# EAGLE schematic new_wiring (EAGLE 6.6.0)
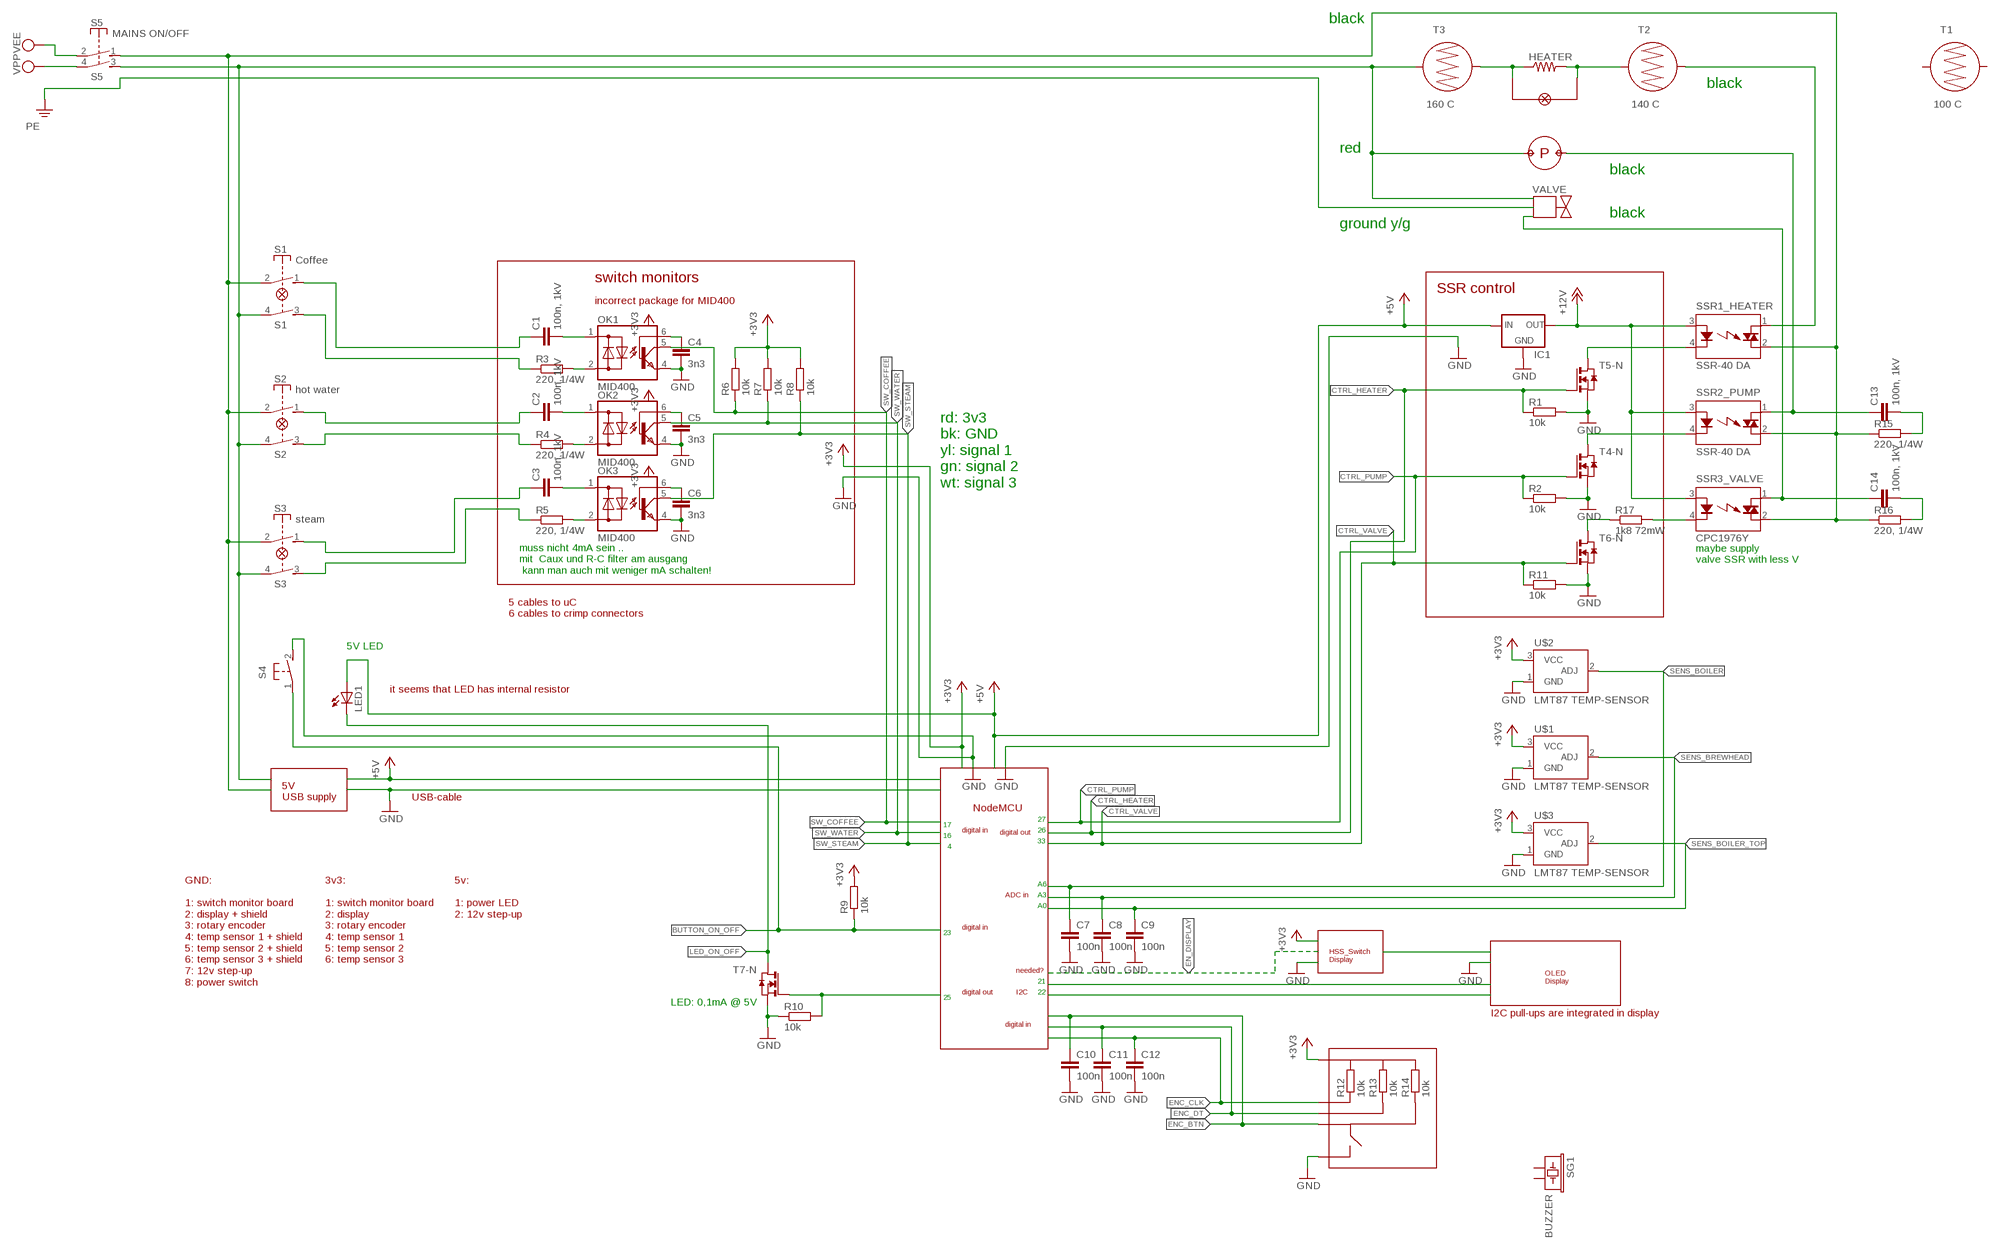
[diagram p0: schematic, sheet 1]

## Parts
C1  100n, 1kV  C-EU025-024X044  [C025-024X044]
C2  100n, 1kV  C-EU025-024X044  [C025-024X044]
C3  100n, 1kV  C-EU025-024X044  [C025-024X044]
C4  3n3  C-EU025-024X044  [C025-024X044]
C5  3n3  C-EU025-024X044  [C025-024X044]
C6  3n3  C-EU025-024X044  [C025-024X044]
C7  100n  C-EU025-024X044  [C025-024X044]
C8  100n  C-EU025-024X044  [C025-024X044]
C9  100n  C-EU025-024X044  [C025-024X044]
C10  100n  C-EU025-024X044  [C025-024X044]
C11  100n  C-EU025-024X044  [C025-024X044]
C12  100n  C-EU025-024X044  [C025-024X044]
C13  100n, 1kV  C-EU025-024X044  [C025-024X044]
C14  100n, 1kV  C-EU025-024X044  [C025-024X044]
FID1  FIDUCIAL1.5X3  [FIDUCIAL-1.5X3]
FID2  FIDUCIAL1.5X3  [FIDUCIAL-1.5X3]
FID3  FIDUCIAL1.5X3  [FIDUCIAL-1.5X3]
FID5  FIDUCIAL1.5X3  [FIDUCIAL-1.5X3]
HEATER  R-US_VTA52  [VTA52]
IC1  LM123-TO3  [TO3-K02]
LED1  LED-3MM-NO_SILK  [LED3MM-NS]
OK1  MID400  IL250  [DIL06]
OK2  MID400  IL250  [DIL06]
OK3  MID400  IL250  [DIL06]
R1  10k  R-EU_0613/5V  [P0613V]
R2  10k  R-EU_0613/5V  [P0613V]
R3  220, 1/4W  R-EU_0613/5V  [P0613V]
R4  220, 1/4W  R-EU_0613/5V  [P0613V]
R5  220, 1/4W  R-EU_0613/5V  [P0613V]
R6  10k  R-EU_0613/5V  [P0613V]
R7  10k  R-EU_0613/5V  [P0613V]
R8  10k  R-EU_0613/5V  [P0613V]
R9  10k  R-EU_0613/5V  [P0613V]
R10  10k  R-EU_0613/5V  [P0613V]
R11  10k  R-EU_0613/5V  [P0613V]
R12  10k  R-EU_0613/5V  [P0613V]
R13  10k  R-EU_0613/5V  [P0613V]
R14  10k  R-EU_0613/5V  [P0613V]
R15  220, 1/4W  R-EU_0613/5V  [P0613V]
R16  220, 1/4W  R-EU_0613/5V  [P0613V]
R17  1k8 72mW  R-EU_0613/5V  [P0613V]
S1  Coffee  PVA1  [PVA1F]
S2  hot water  PVA1  [PVA1F]
S3  steam  PVA1  [PVA1F]
S4  31-XX  [B3F-31XX]
S5  MAINS ON/OFF  PVA1  [PVA1F]
SG1  BUZZER  BUZZERNS  [BUZZER-12MM-NS]
SSR1_HEATER  SSR-40 DA  S101T01  [S102T0X]
SSR2_PUMP  SSR-40 DA  S101T01  [S102T0X]
SSR3_VALVE  CPC1976Y  S101T01  [S102T0X]
T1  100 C  BUTTON-CONDUCTIVESMD  [BUTTON-CONDUCTIVE]
T2  140 C  BUTTON-CONDUCTIVESMD  [BUTTON-CONDUCTIVE]
T3  160 C  BUTTON-CONDUCTIVESMD  [BUTTON-CONDUCTIVE]
T4  N/P-MOS-DMG1029SV  [SOT-563]
T5  N/P-MOS-DMG1029SV  [SOT-563]
T6  N/P-MOS-DMG1029SV  [SOT-563]
T7  N/P-MOS-DMG1029SV  [SOT-563]
TP1  TPB1,27  [B1,27]
TP2  TPB1,27  [B1,27]
U$1  LMT87 TEMP-SENSOR  TEMPERATURE-SENSOR  [TO-92]
U$2  LMT87 TEMP-SENSOR  TEMPERATURE-SENSOR  [TO-92]
U$3  LMT87 TEMP-SENSOR  TEMPERATURE-SENSOR  [TO-92]

## Nets
+3V3: R6.2 R7.2 R8.2 R9.2 U$1.3(VCC) U$2.3(VCC) U$3.3(VCC)
+5V: IC1.2(IN) LED1.A
+12V: IC1.1(OUT) SSR1_HEATER.3(A) SSR2_PUMP.3(A) SSR3_VALVE.3(A)
BUTTON_ON_OFF: R9.1 S4.1(P)
CTRL_HEATER: R1.1 T5.2(-N:G)
CTRL_PUMP: R2.1 T4.2(-N:G)
CTRL_VALVE: R11.1 T6.2(-N:G)
ENC_BTN: C10.1
ENC_CLK: C12.1
ENC_DT: C11.1
GND: C4.2 C5.2 C6.2 C7.2 C8.2 C9.2 C10.2 C11.2 C12.2 IC1.3(GND) OK1.4(E) OK2.4(E) OK3.4(E) R1.2 R2.2 R10.1 R11.2 S4.2(S) T4.1(-N:S) T5.1(-N:S) T6.1(-N:S) T7.1(-N:S) U$1.1(GND) U$2.1(GND) U$3.1(GND)
LED_ON_OFF: LED1.K(C) T7.6(-N:D)
N$1: C13.1 SSR2_PUMP.1(DS1) TP1.TP
N$2: HEATER.1 T3.2
N$3: HEATER.2 T2.1
N$4: SSR1_HEATER.1(DS1) T2.2
N$5: SSR1_HEATER.4(K) T5.6(-N:D)
N$6: SSR2_PUMP.4(K) T4.6(-N:D)
N$10: C1.1 S1.1(1:S)
N$11: R3.1 S1.3(2:S)
N$12: R10.2 T7.2(-N:G)
N$13: R15.1 R16.1 S1.2(1:P) S2.2(1:P) S3.2(1:P) S5.1(1:S) SSR1_HEATER.2(DS2) SSR2_PUMP.2(DS2) SSR3_VALVE.2(DS2)
N$14: S1.4(2:P) S2.4(2:P) S3.4(2:P) S5.3(2:S) T3.1 TP2.TP
N$15: C1.2 OK1.1(AC1)
N$16: C3.1 S3.1(1:S)
N$17: R5.1 S3.3(2:S)
N$18: C2.1 S2.1(1:S)
N$19: R4.1 S2.3(2:S)
N$20: OK1.2(AC2) R3.2
N$21: C2.2 OK2.1(AC1)
N$22: OK2.2(AC2) R4.2
N$23: C3.2 OK3.1(AC1)
N$24: OK3.2(AC2) R5.2
N$25: C6.1 OK3.6(B)
N$26: C5.1 OK2.6(B)
N$27: C4.1 OK1.6(B)
N$28: R17.1 T6.6(-N:D)
N$29: C14.1 SSR3_VALVE.1(DS1)
N$30: R17.2 SSR3_VALVE.4(K)
N$31: C13.2 R15.2
N$32: C14.2 R16.2
SENS_BOILER: C7.1 U$2.2(ADJ)
SENS_BOILER_TOP: C9.1 U$3.2(ADJ)
SENS_BREWHEAD: C8.1 U$1.2(ADJ)
SW_COFFEE: OK1.5(C) R6.1
SW_STEAM: OK3.5(C) R8.1
SW_WATER: OK2.5(C) R7.1
VEE: S5.2(1:P)
VPP: S5.4(2:P)
Unconnected: R12.1 R12.2 R13.1 R13.2 R14.1 R14.2 SG1.+ SG1.- T1.1 T1.2 T4.3(-P:D) T4.4(-P:S) T4.5(-P:G) T5.3(-P:D) T5.4(-P:S) T5.5(-P:G) T6.3(-P:D) T6.4(-P:S) T6.5(-P:G) T7.3(-P:D) T7.4(-P:S) T7.5(-P:G)

## Notes on the sheet
- black
- black
- red | P
- black
- VALVE
- black
- ground y/g
- switch monitors
- SSR control
- incorrect package for MID400
- rd: 3v3
  bk: GND
  yl: signal 1
  gn: signal 2
  wt: signal 3
- maybe supply 
  valve SSR with less V
- muss nicht 4mA sein ..
  mit  Caux und R-C filter am ausgang
   kann man auch mit weniger mA schalten!
- 5 cables to uC
  6 cables to crimp connectors
- 5V LED
- it seems that LED has internal resistor
- 5V
  USB supply
- USB-cable
- NodeMCU
- 17 | 27
- 16 | digital in | 26
- digital out
- 4 | 33
- GND:
  
  1: switch monitor board
  2: display + shield
  3: rotary encoder
  4: temp sensor 1 + shield
  5: temp sensor 2 + shield
  6: temp sensor 3 + shield
  7: 12v step-up
  8: power switch
- 3v3:
  
  1: switch monitor board
  2: display
  3: rotary encoder
  4: temp sensor 1
  5: temp sensor 2
  6: temp sensor 3
- 5v:
  
  1: power LED
  2: 12v step-up
- A6
- ADC in | A3
- A0
- 23 | digital in
- HSS_Switch
  Display
- needed?
- 21
- OLED
  Display
- 25 | digital out | I2C | 22
- LED: 0,1mA @ 5V
- I2C pull-ups are integrated in display
- digital in

## Library data of the parts
C1-C14 = rcl:C-EU: CAPACITOR, European symbol
FID1-FID3 FID5 = SparkFun-Retired:FIDUCIAL: Fiducial Alignment Points Various fiducial points for machine vision alignment.
HEATER = rcl:R-US_: RESISTOR, American symbol
IC1 = v-reg:LM123-TO3: VOLTAGE REGULATOR
LED1 = SparkFun:LED: LEDs Standard schematic elements and footprints for 5mm, 3mm, 1206, and 0603 sized LEDs. 5mm - Spark Fun Electronics SKU : COM-00529 (and others)
OK1-OK3 = optocoupler:IL250: SIEMENS OPTO COUPLER; MF: VISHAY/TELEFUNKEN; MPN: IL250; OC_FARNELL: 1469559; OC_NEWARK: 58K1705
R1-R17 = rcl:R-EU_: RESISTOR, European symbol
S1-S3 S5 = switch-misc:PVA1: ITT SWITCH
S4 = switch-omron:31-XX: OMRON SWITCH; MPN: B3F-3100; OC_FARNELL: 959704; OC_NEWARK: 36M3582
SG1 = SparkFun:BUZZER: Buzzer 12mm Spark Fun Electronics SKU : Comp-Buzzer
SSR1_HEATER SSR2_PUMP SSR3_VALVE = relay:S?*: Low Height Type Solid State Relays SHARP Source: 162574-da-01-en-S202T02_Solid_State_Relais.pdf Source: http://sharp-world.com .. s102s11_e.pdf; OC_FARNELL: unknown; OC_NEWARK: unknown
T1-T3 = SparkFun:BUTTON-CONDUCTIVE: Conductive Button Used with rubber key pads. This one was designed and proven to work with the PolyCase Key FOB enclosures.
T4-T7 = usr_gerneral:N/P-MOS-*: COMPLEMENTARY PAIR ENHANCEMENT MODE MOSFET Source: http://www.diodes.com/datasheets/DMG1029SV.pdf; DISTRIBUTOR: Digikey; OC_DIGIKEY: DMG1029SV-7DICT-ND; ORDER_CODE: DMG1029SV-7DICT-ND
TP1 TP2 = testpad:TP: Test pad
U$1-U$3 = SparkFun-Sensors:TEMPERATURE-SENSOR: TO-92 temp sensor